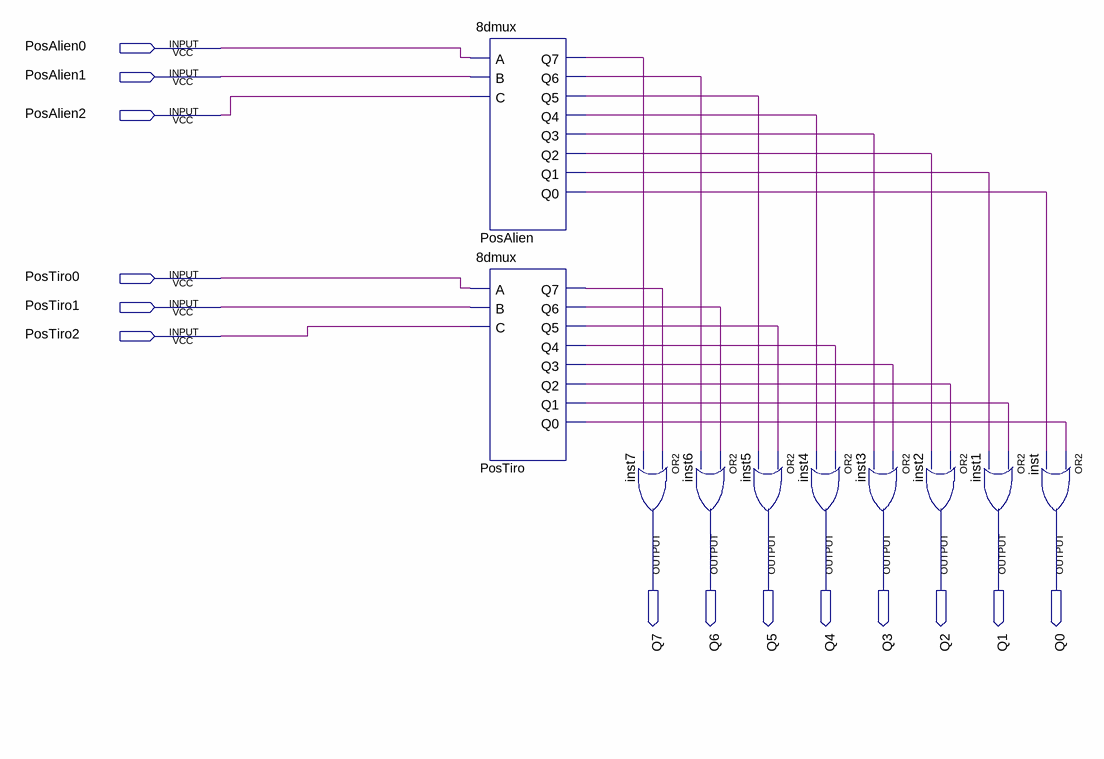
[diagram p0: schematic sheet]
// Quartus schematic CombinadorAlienTiro.bdf as structural Verilog: 10 symbols, 14 pins
module CombinadorAlienTiro (
  input  PosAlien0,
  input  PosAlien1,
  input  PosAlien2,
  input  PosTiro0,
  input  PosTiro1,
  input  PosTiro2,
  output Q7,
  output Q6,
  output Q5,
  output Q4,
  output Q3,
  output Q2,
  output Q1,
  output Q0
);

  wire PosAlien_q0, PosAlien_q1, PosAlien_q2, PosAlien_q3, PosAlien_q4, PosAlien_q5, PosAlien_q6,
       PosAlien_q7, PosTiro_q0, PosTiro_q1, PosTiro_q2, PosTiro_q3, PosTiro_q4, PosTiro_q5, PosTiro_q6,
       PosTiro_q7;

  \8dmux  PosAlien (
    .A(PosAlien0), .B(PosAlien1), .C(PosAlien2), .Q7(PosAlien_q7), .Q6(PosAlien_q6), .Q5(PosAlien_q5),
    .Q4(PosAlien_q4), .Q3(PosAlien_q3), .Q2(PosAlien_q2), .Q1(PosAlien_q1), .Q0(PosAlien_q0));
  \8dmux  PosTiro (
    .A(PosTiro0), .B(PosTiro1), .C(PosTiro2), .Q7(PosTiro_q7), .Q6(PosTiro_q6), .Q5(PosTiro_q5),
    .Q4(PosTiro_q4), .Q3(PosTiro_q3), .Q2(PosTiro_q2), .Q1(PosTiro_q1), .Q0(PosTiro_q0));
  or inst7 (Q7, PosTiro_q7, PosAlien_q7);
  or inst6 (Q6, PosTiro_q6, PosAlien_q6);
  or inst4 (Q4, PosTiro_q4, PosAlien_q4);
  or inst5 (Q5, PosTiro_q5, PosAlien_q5);
  or inst3 (Q3, PosTiro_q3, PosAlien_q3);
  or inst2 (Q2, PosTiro_q2, PosAlien_q2);
  or inst (Q0, PosTiro_q0, PosAlien_q0);
  or inst1 (Q1, PosTiro_q1, PosAlien_q1);
endmodule
